# EAGLE design 508_outin_imp (EAGLE 9.6.2)
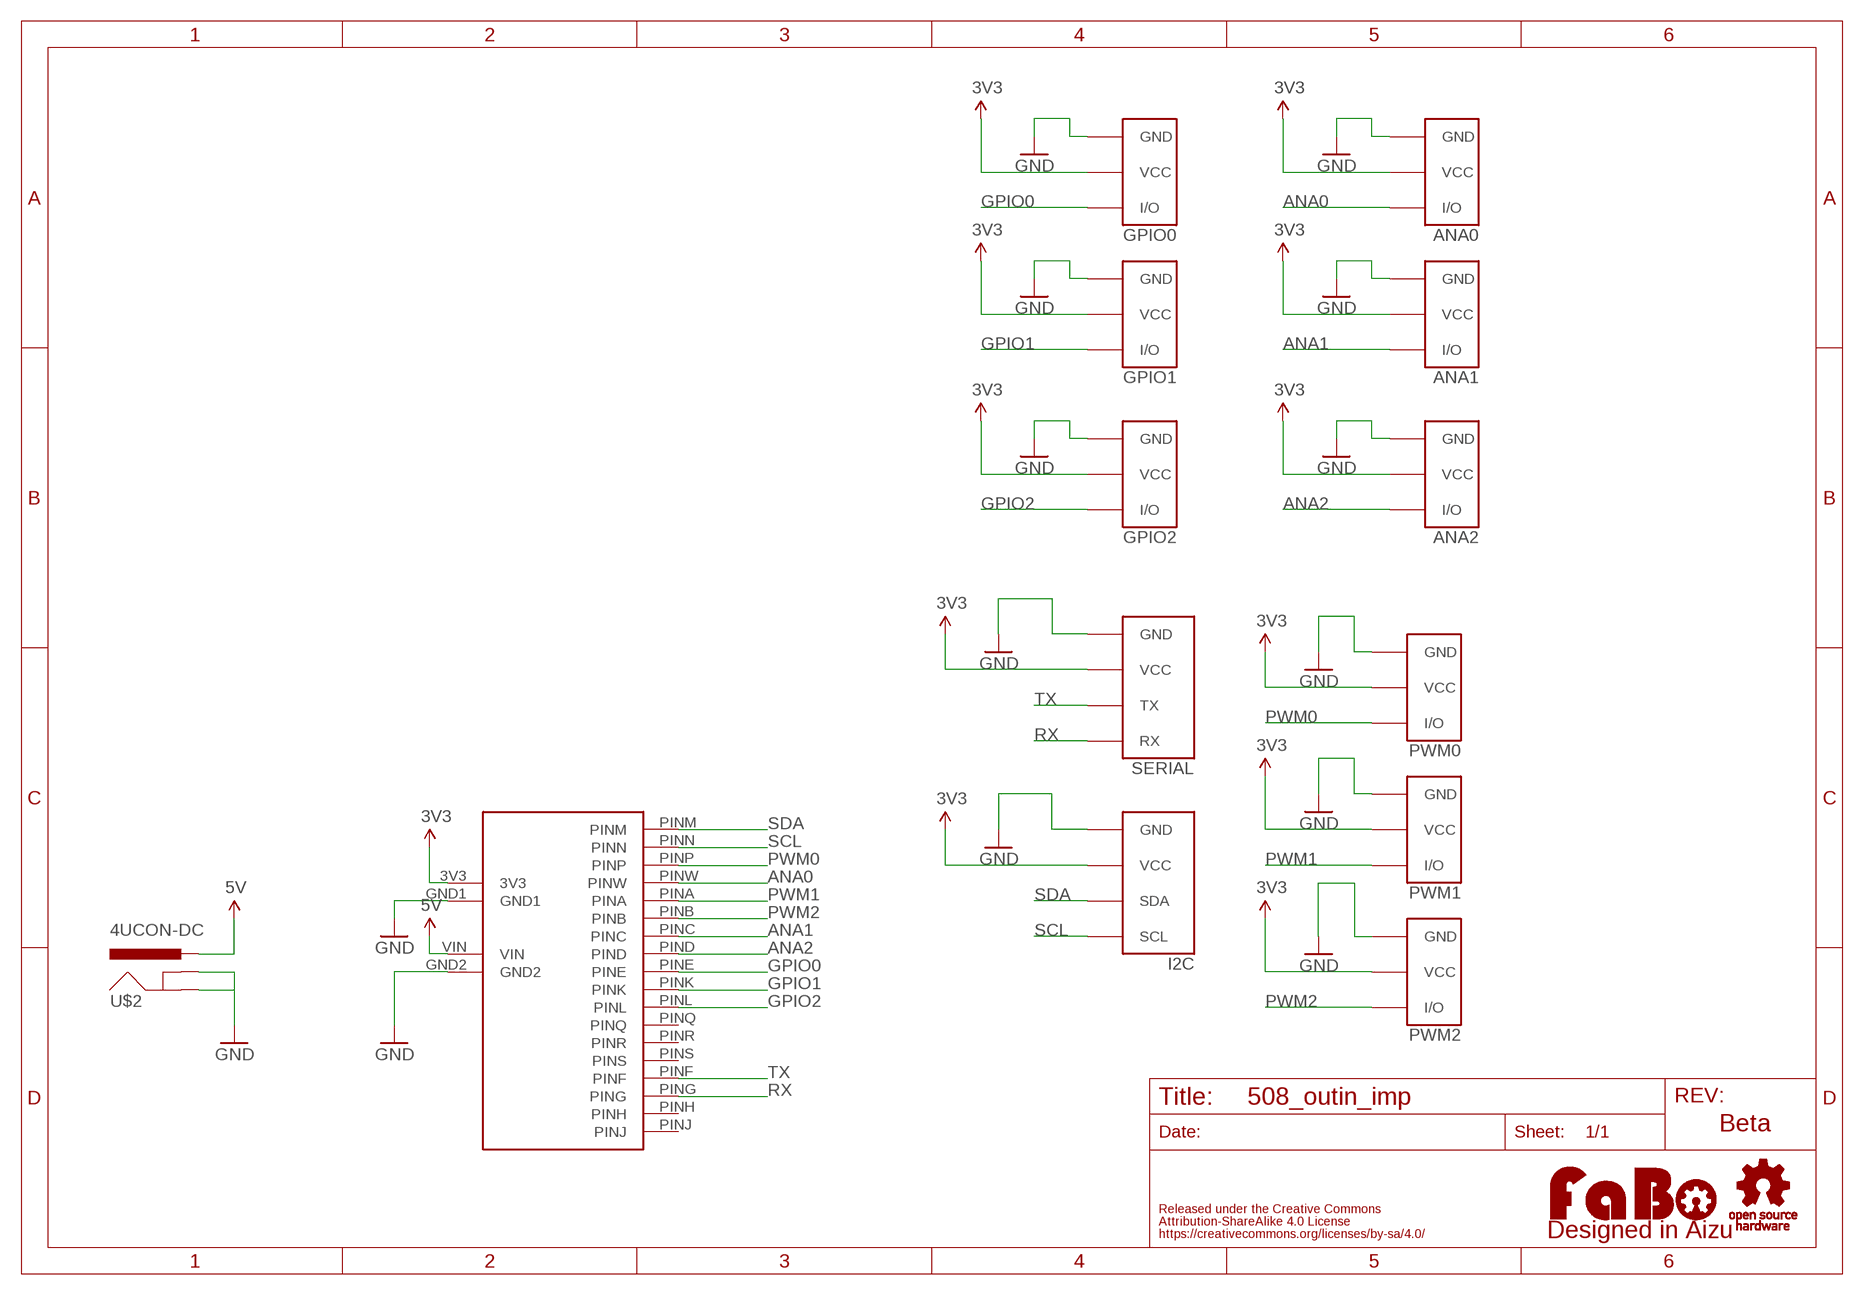
[diagram p0: schematic, sheet 1]

## Parts
ANA0  FABO_BRICK_3PIN-B03B-PASK-1_SILK  [FABO_BRICK_3PIN_B03B-PASK-1_SILK]
ANA1  FABO_BRICK_3PIN-B03B-PASK-1_SILK  [FABO_BRICK_3PIN_B03B-PASK-1_SILK]
ANA2  FABO_BRICK_3PIN-B03B-PASK-1_SILK  [FABO_BRICK_3PIN_B03B-PASK-1_SILK]
GPIO0  FABO_BRICK_3PIN-B03B-PASK-1_SILK  [FABO_BRICK_3PIN_B03B-PASK-1_SILK]
GPIO1  FABO_BRICK_3PIN-B03B-PASK-1_SILK  [FABO_BRICK_3PIN_B03B-PASK-1_SILK]
GPIO2  FABO_BRICK_3PIN-B03B-PASK-1_SILK  [FABO_BRICK_3PIN_B03B-PASK-1_SILK]
I2C  FABO_BRICK_I2C-S04B-PASK-2_LONG  [FABO_BRICK_I2C_S04B-PASK-2_LONG]
LOGO1  LOGO_FABO-M  [LOGO_FABO_M]
PWM0  FABO_BRICK_3PIN-HEADER  [FABO_BRICK_3PIN_HEADER]
PWM1  FABO_BRICK_3PIN-HEADER  [FABO_BRICK_3PIN_HEADER]
PWM2  FABO_BRICK_3PIN-HEADER  [FABO_BRICK_3PIN_HEADER]
SERIAL  FABO_BRICK_SERIAL-S04B-PASK-2_LONG  [FABO_BRICK_SERIAL_S04B-PASK-2_LONG]
U$1  FABO-IMP  [FABO-IMP]
U$2  4UCON-DC  [4UCON-DC]
U$3  LOGO_OSHW-M_BOTTOM  [LOGO_OSHW_M_BOTTOM]

## Nets
3V3: ANA0.VCC ANA1.VCC ANA2.VCC GPIO0.VCC GPIO1.VCC GPIO2.VCC I2C.VCC PWM0.VCC PWM1.VCC PWM2.VCC SERIAL.VCC U$1.3V3
5V: U$1.VIN U$2.VCC(PWR)
ANA0: ANA0.I/O U$1.PINW
ANA1: ANA1.I/O U$1.PINC
ANA2: ANA2.I/O U$1.PIND
GND: ANA0.GND ANA1.GND ANA2.GND GPIO0.GND GPIO1.GND GPIO2.GND I2C.GND PWM0.GND PWM1.GND PWM2.GND SERIAL.GND U$1.GND1 U$1.GND2 U$2.GND1(GND) U$2.GND2(GNDBREAK)
GPIO0: GPIO0.I/O U$1.PINE
GPIO1: GPIO1.I/O U$1.PINK
GPIO2: GPIO2.I/O U$1.PINL
PWM0: PWM0.I/O U$1.PINP
PWM1: PWM1.I/O U$1.PINA
PWM2: PWM2.I/O U$1.PINB
RX: SERIAL.RX U$1.PING
SCL: I2C.SCL U$1.PINN
SDA: I2C.SDA U$1.PINM
TX: SERIAL.TX U$1.PINF
Unconnected: U$1.PINH U$1.PINJ U$1.PINQ U$1.PINR U$1.PINS

## Notes on the sheet
- Beta

## Library data of the parts
ANA0 ANA1 ANA2 GPIO0 GPIO1 GPIO2 PWM0 PWM1 PWM2 = FaBo-Template:FABO_BRICK_3PIN: FaBo Brick 3pin
I2C = FaBo-Template:FABO_BRICK_I2C: FaBo Brick I2C
LOGO1 = component:LOGO_FABO
SERIAL = FaBo-Template:FABO_BRICK_SERIAL: FaBo Brick Serial
U$1 = FaBo-Template:FABO-IMP
U$2 = FaBo-Supply:4UCON-DC
U$3 = component:LOGO_OSHW

## Board
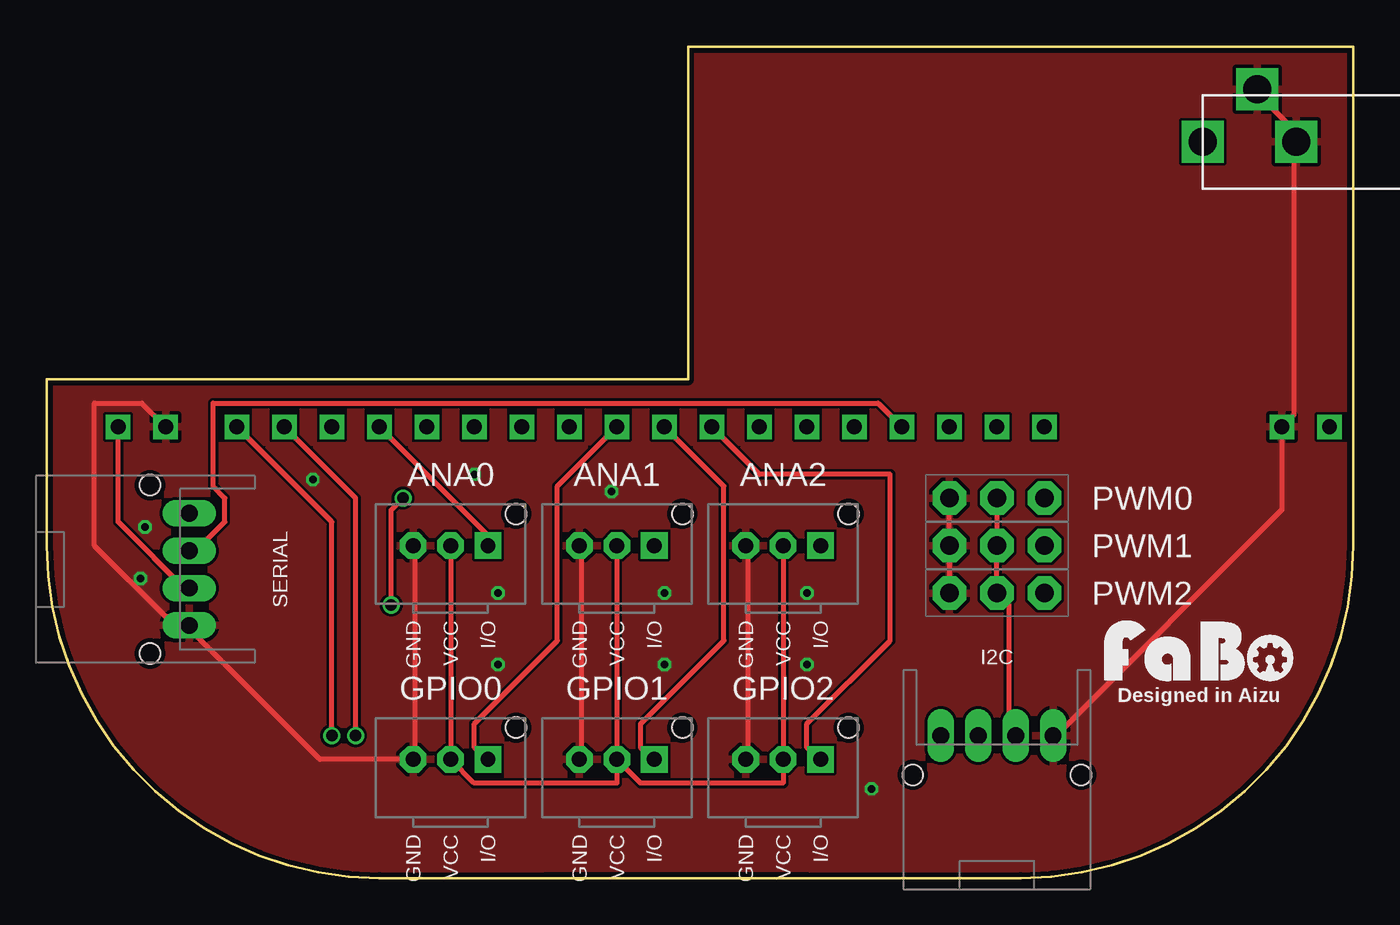
[diagram p1: board, top side]
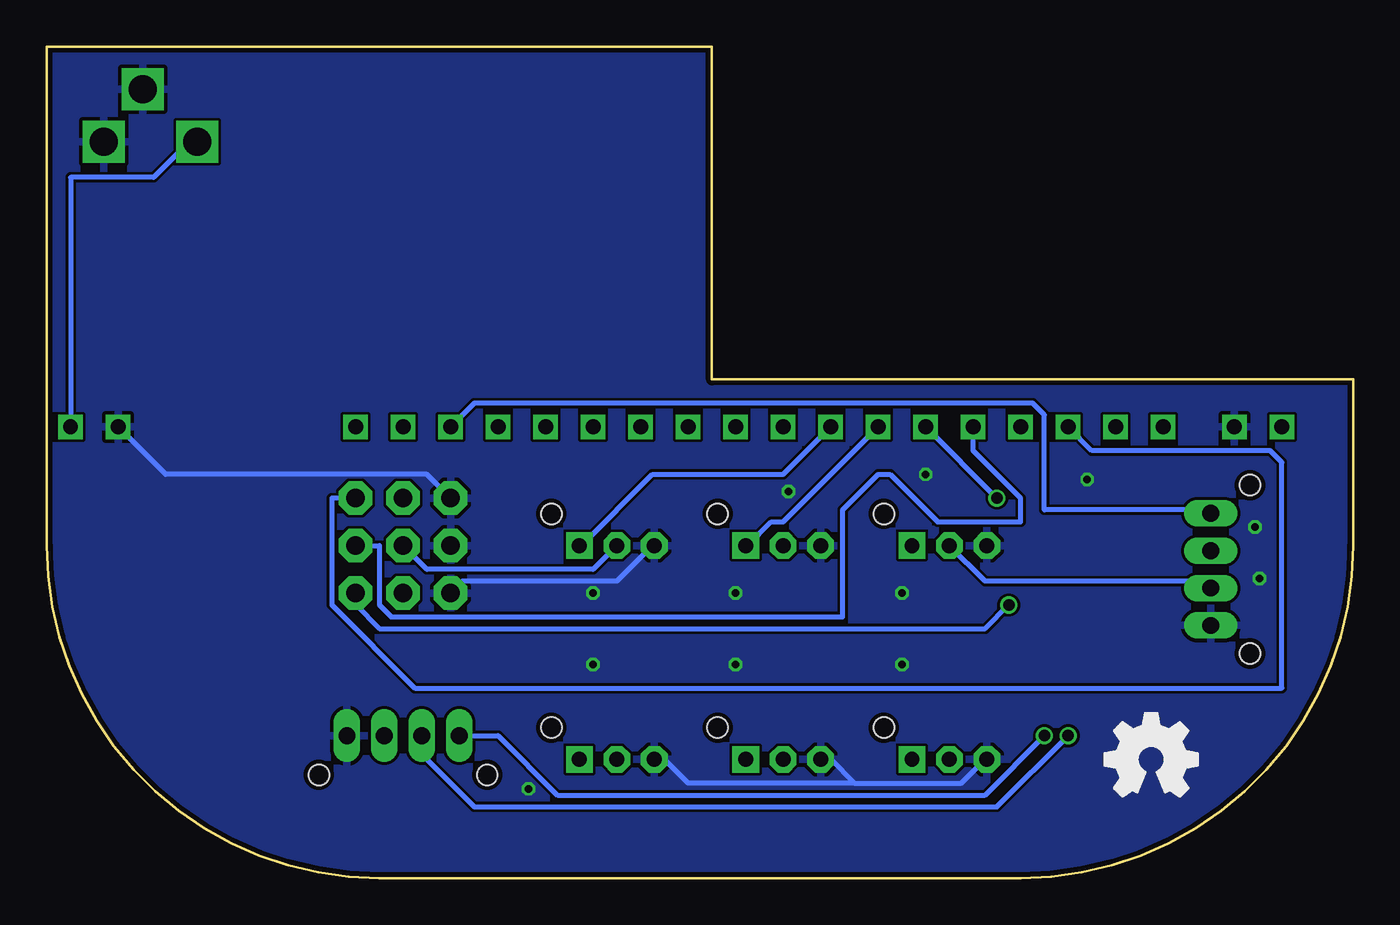
[diagram p2: board, bottom side, seen from below]

Size 69.85 x 44.45 mm. Coordinates in mm from the lower left corner, seen from the top.
Copper layers (1*16): Top 0.035mm / dielectric 1.6mm / Bottom 0.035mm
Design rules "PCBway": minimum track width 6mil, minimum drill 12mil, track to track 6mil, track to pad 6mil, pad to pad 6mil, via to via 6mil, smd to smd 6mil, copper to edge 10mil, drill to drill 10mil, minimum pad ring 10mil, minimum via ring 6mil, stop-mask expansion 2mil, vias tented up to drill 100mil, thermal gap 8mil

### Footprints (pad centres in the part's own frame; a part is rotated, then mirrored left to right if it is on the bottom)
FABO_BRICK_3PIN_B03B-PASK-1_SILK = drill 0.8 pad 1.422 octagon: GND -2,0; VCC 0,0 | drill 0.8 pad 1.422 square: I/O 2,0 | hole 1.1: 3.5,1.7
FABO_BRICK_I2C_S04B-PASK-2_LONG = drill 0.9 pad 1.422 long: GND -3,0; SCL 3,0; SDA 1,0; VCC -1,0 | hole 1.1: 4.5,2.1; -4.5,2.1
FABO_BRICK_3PIN_HEADER = drill 1 pad 1.778 octagon: GND -2.54,0; I/O 2.54,0; VCC 0,0
FABO_BRICK_SERIAL_S04B-PASK-2_LONG = drill 0.9 pad 1.422 long: GND -3,0; RX 3,0; TX 1,0; VCC -1,0 | hole 1.1: 4.5,2.1; -4.5,2.1
FABO-IMP = drill 0.8 square: 3V3 -31.75,0; GND1 -29.21,0; GND2 30.48,0; PINA -15.24,0; PINB -12.7,0; PINC -10.16,0; PIND -7.62,0; PINE -5.08,0; PINF 10.16,0; PING 12.7,0; PINH 15.24,0; PINJ 17.78,0; PINK -2.54,0; PINL 0,0; PINM -25.4,0; PINN -22.86,0; PINP -20.32,0; PINQ 2.54,0; PINR 5.08,0; PINS 7.62,0; PINW -17.78,0; VIN 33.02,0
4UCON-DC = drill 1.5 square: GND1 0.5,0; GND2 2.6,-2.8; VCC 5.5,0

### Placement (x,y rotation side)
ANA0  21.59,17.78 0 top
ANA1  30.48,17.78 0 top
ANA2  39.37,17.78 0 top
GPIO0  21.59,6.35 0 top
GPIO1  30.48,6.35 0 top
GPIO2  39.37,6.35 0 top
I2C  50.8,7.62 180 top
LOGO1  61.6,10.16 0 top
PWM0  50.8,20.32 0 top
PWM1  50.8,17.78 0 top
PWM2  50.8,15.24 0 top
SERIAL  7.62,16.51 90 top
U$1  35.56,24.13 0 top
U$2  67.31,39.37 180 top
U$3  10.8,6.35 0 top

### Tracks (layer width: path | path; a pad name or v marks a point on that pad's centre or on a via)
3V3
  Top 0.254: ANA0.VCC GPIO0.VCC 22.86,5.08 30.48,5.08 GPIO1.VCC | U$1.3V3 3.81,19.05 7.62,15.24 SERIAL.VCC | PWM0.VCC PWM1.VCC PWM2.VCC 51.44,14.61 51.44,7.62 I2C.VCC | ANA1.VCC GPIO1.VCC | ANA2.VCC GPIO2.VCC 39.37,5.08 31.75,5.08 GPIO1.VCC
  Bottom 0.254: ANA0.VCC 19.69,15.88 7.62,15.88 SERIAL.VCC | PWM1.VCC 49.53,16.51 40.64,16.51 ANA2.VCC
5V
  Bottom 0.254: U$1.VIN 68.58,37.47 64.14,37.47 62.23,39.37 U$2.VCC
ANA0
  Top 0.254: U$1.PINW 23.5,18.41 23.5,17.78 ANA0.I/O
ANA1
  Bottom 0.254: U$1.PINC 30.48,19.05 31.12,19.05 32.39,17.78 ANA1.I/O
ANA2
  Bottom 0.254: U$1.PIND 30.48,21.59 37.47,21.59 41.28,17.78 ANA2.I/O
GND  (via drill 0.41)
  Top 0.254: 66.67,39.37 66.67,24.77 U$1.GND2 66.04,19.68 53.98,7.62 I2C.GND | 66.67,39.37 66.67,40.01 64.77,41.91 U$2.GND2 | 66.67,39.37 U$2.GND1 | PWM2.GND PWM1.GND PWM0.GND | GPIO2.GND 37.47,6.35 37.47,17.78 ANA2.GND | U$1.GND1 5.08,25.4 2.54,25.4 2.54,17.78 6.35,13.97 7.62,13.97 SERIAL.GND 7.62,13.34 14.61,6.35 GPIO0.GND 19.69,6.35 19.69,17.78 ANA0.GND | GPIO1.GND 28.58,6.35 28.58,17.78 ANA1.GND
  Bottom 0.254: PWM2.GND 47.63,15.88 39.37,15.88 37.47,17.78 ANA2.GND | 26.67,5.08 20.96,5.08 19.69,6.35 GPIO0.GND | 26.67,5.08 27.94,6.35 GPIO1.GND | 26.67,5.08 35.56,5.08 36.83,6.35 GPIO2.GND | U$1.GND2 63.5,21.59 49.53,21.59 PWM0.GND
  other vias: 24.13,11.43 24.13,15.24 33.02,15.24 33.02,11.43 40.64,15.24 40.64,11.43 22.86,21.59 14.22,21.31 30.2,20.68 5,16.03 5.26,18.77 44.09,4.78
  pour Top: -1.27,0 69.85,0 69.85,44.45 -1.27,44.45
  pour Bottom: -1.27,0 69.85,0 69.85,44.45 -1.27,44.45
GPIO0
  Top 0.254: U$1.PINE 27.31,20.95 27.31,12.7 22.86,8.26 22.86,6.99 23.5,6.35 GPIO0.I/O
GPIO1
  Top 0.254: U$1.PINK 36.2,20.95 36.2,12.7 31.75,8.26 31.75,6.99 32.39,6.35 GPIO1.I/O
GPIO2
  Top 0.254: U$1.PINL 38.1,21.59 45.09,21.59 45.09,12.7 40.64,8.26 40.64,6.99 41.28,6.35 GPIO2.I/O
PWM0
  Bottom 0.254: U$1.PINP 13.97,22.86 4.45,22.86 3.81,22.23 3.81,10.16 50.17,10.16 54.61,14.61 54.61,20.32 PWM0.I/O
PWM1
  Bottom 0.254: U$1.PINA 20.32,22.86 17.78,20.32 17.78,19.05 22.23,19.05 24.77,21.59 25.4,21.59 27.31,19.68 27.31,13.97 51.44,13.97 52.07,14.61 52.07,17.78 PWM1.I/O
PWM2  (via drill 0.61)
  Top 0.254: v19.05,20.32 18.42,19.68 v18.42,14.61
  Bottom 0.254: v19.05,20.32 U$1.PINB | v18.42,14.61 19.69,13.34 52.07,13.34 53.34,14.61 PWM2.I/O
RX
  Bottom 0.254: U$1.PING 46.99,25.4 17.15,25.4 16.51,24.77 16.51,19.68 7.62,19.68 SERIAL.RX
SCL  (via drill 0.61)
  Top 0.254: U$1.PINN 16.51,20.32 v16.51,7.62
  Bottom 0.254: v16.51,7.62 19.69,4.45 42.55,4.45 45.72,7.62 I2C.SCL
SDA  (via drill 0.61)
  Top 0.254: U$1.PINM 15.24,19.05 v15.24,7.62
  Bottom 0.254: v15.24,7.62 19.05,3.81 46.99,3.81 49.53,6.35 49.53,7.62 I2C.SDA
TX
  Top 0.254: U$1.PINF 44.45,25.4 8.89,25.4 8.89,20.95 9.53,20.32 9.53,19.05 7.62,17.14 SERIAL.TX

### Text on the board
tPlace: Designed in Aizu